# Altium schematic sheet BLDC_MC_Schematic.SchDoc
size A4; SheetNumber: 1; SheetTotal: 1
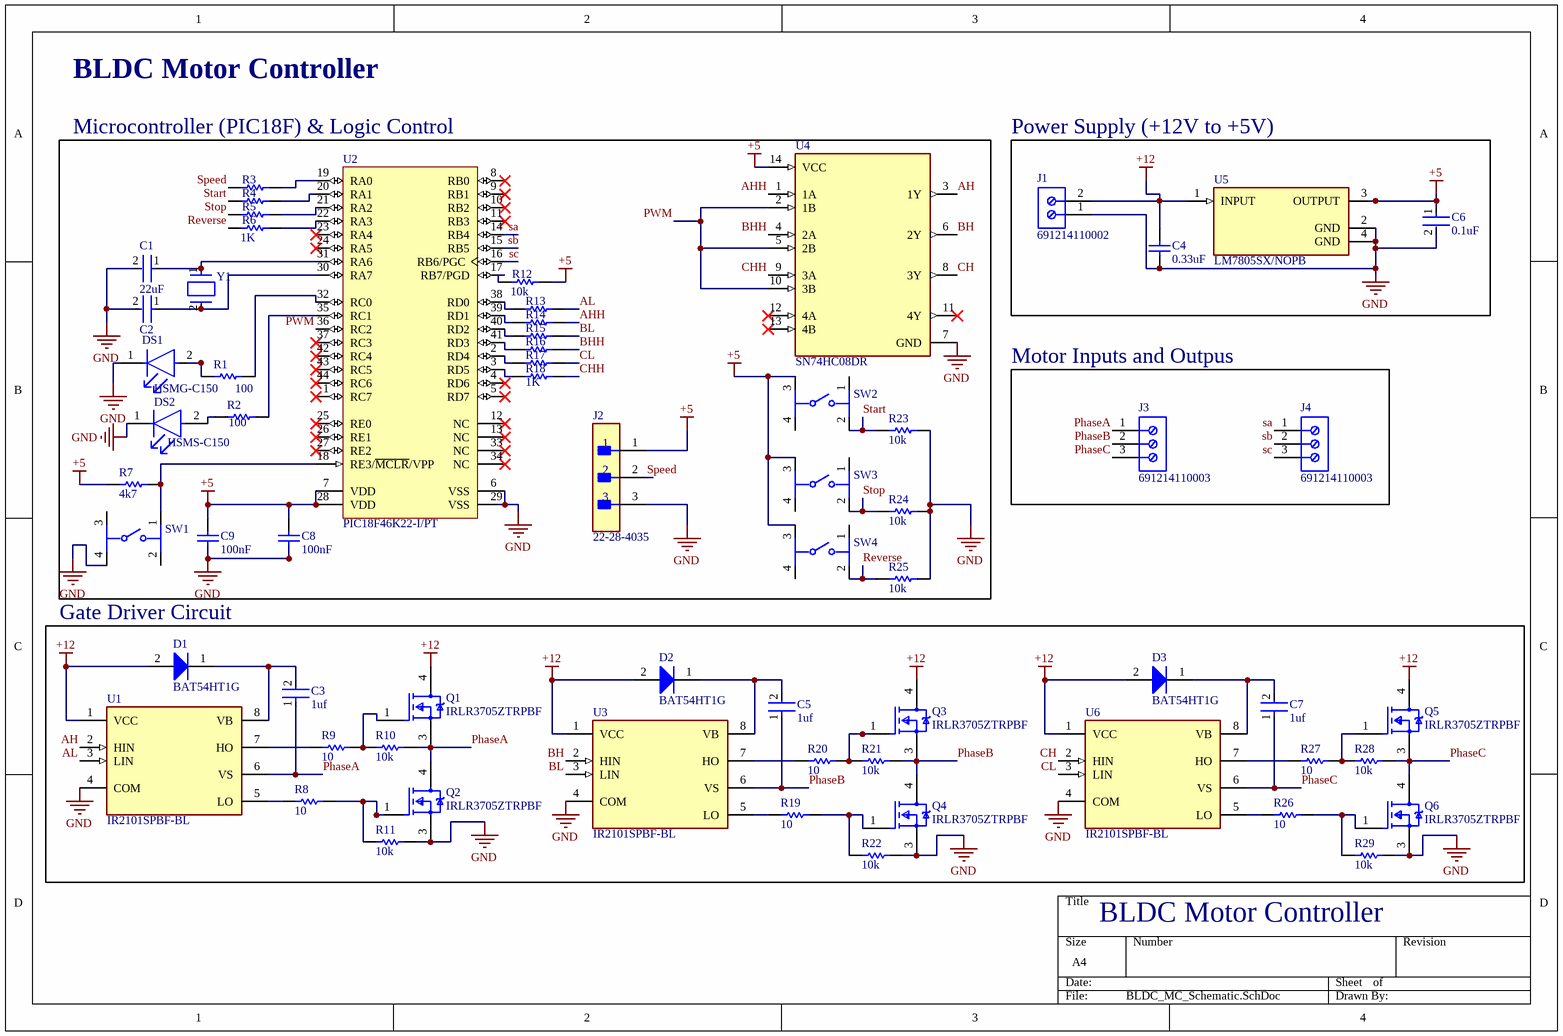
[diagram p0: BLDC_MC_Schematic.SchDoc]

## Parts
C1  22uF  [FP-GRM21B-0_15-MFG]
C2  22uF  [FP-GRM21B-0_15-MFG]  (value not drawn)
C3  1uf  [FP-GRM55D-0_4-IPC_A]
C4  0.33uF  [CAPC1005X55X25ML05T10]
C5  1uf  [FP-GRM55D-0_4-IPC_A]
C6  0.1uF  [FP-C1005-050-0_05-IPC_C]
C7  1uf  [FP-GRM55D-0_4-IPC_A]
C8  100nF  [CAPC1005X56X25ML10T15]
C9  100nF  [CAPC1005X56X25ML10T15]
D1  BAT54HT1G  [ONSC-SOD-323-2-477-02_V]
D2  BAT54HT1G  [ONSC-SOD-323-2-477-02_V]
D3  BAT54HT1G  [ONSC-SOD-323-2-477-02_V]
DS1  HSMG-C150  [FP-HSMG-C150-MFG]
DS2  HSMS-C150  [FP-HSMS-C150-MFG]
J1  691214110002  [691214110002]
J2  22-28-4035  [FP-22-28-4035-MFG]
J3  691214110003  [691214110003]
J4  691214110003  [691214110003]
Q1  IRLR3705ZTRPBF  [FP-PG-TO252-3-MFG]
Q2  IRLR3705ZTRPBF  [FP-PG-TO252-3-MFG]
Q3  IRLR3705ZTRPBF  [FP-PG-TO252-3-MFG]
Q4  IRLR3705ZTRPBF  [FP-PG-TO252-3-MFG]
Q5  IRLR3705ZTRPBF  [FP-PG-TO252-3-MFG]
Q6  IRLR3705ZTRPBF  [FP-PG-TO252-3-MFG]
R1  100  [RESC1608X55X30LL15T15]
R2  100  [RESC1608X55X30LL15T15]
R3  1K  [RESC1608X55X30LL15T15]  (value not drawn)
R4  1K  [RESC1608X55X30LL15T15]  (value not drawn)
R5  1K  [RESC1608X55X30LL15T15]  (value not drawn)
R6  1K  [RESC1608X55X30LL15T15]
R7  4k7  [RESC1005X40X25LL05T05]
R8  10  [RESC2013X50X30NL20T20]
R9  10  [RESC2013X50X30NL20T20]
R10  10k  [RESC1609X50X30NL8T20]
R11  10k  [RESC1609X50X30NL8T20]
R12  10k  [RESC1609X50X30NL8T20]
R13  1K  [RESC1608X55X30LL15T15]  (value not drawn)
R14  1K  [RESC1608X55X30LL15T15]  (value not drawn)
R15  1K  [RESC1608X55X30LL15T15]  (value not drawn)
R16  1K  [RESC1608X55X30LL15T15]  (value not drawn)
R17  1K  [RESC1608X55X30LL15T15]  (value not drawn)
R18  1K  [RESC1608X55X30LL15T15]
R19  10  [RESC2013X50X30NL20T20]
R20  10  [RESC2013X50X30NL20T20]
R21  10k  [RESC1609X50X30NL8T20]
R22  10k  [RESC1609X50X30NL8T20]
R23  10k  [RESC1609X50X30NL8T20]
R24  10k  [RESC1609X50X30NL8T20]
R25  10k  [RESC1609X50X30NL8T20]
R26  10  [RESC2013X50X30NL20T20]
R27  10  [RESC2013X50X30NL20T20]
R28  10k  [RESC1609X50X30NL8T20]
R29  10k  [RESC1609X50X30NL8T20]
SW1  PTS810SJM250SMTRLFS  [FP-PTS810SJM250SMTRLFS-MFG]  (value not drawn)
SW2  PTS810SJM250SMTRLFS  [FP-PTS810SJM250SMTRLFS-MFG]  (value not drawn)
SW3  PTS810SJM250SMTRLFS  [FP-PTS810SJM250SMTRLFS-MFG]  (value not drawn)
SW4  PTS810SJM250SMTRLFS  [FP-PTS810SJM250SMTRLFS-MFG]  (value not drawn)
U1  IR2101SPBF-BL  [FP-PG-DSO-8-IPC_B]
U2  PIC18F46K22-I/PT  [MCHP-TQFP-PT44_L]
U3  IR2101SPBF-BL  [FP-PG-DSO-8-IPC_B]
U4  SN74HC08DR  [FP-D0014A-MFG]
U5  LM7805SX/NOPB  [FP-KTT0003B-MFG]
U6  IR2101SPBF-BL  [FP-PG-DSO-8-IPC_B]
Y1  ABM7-16.000MHZ-D2Y-T  [FP-ABM7-MFG]  (value not drawn)

## Blocks framed on the sheet
Microcontroller (PIC18F) & Logic Control: C1 C2 C8 C9 DS1 DS2 J2 R1-R7 R12-R18 R23-R25 SW1-SW4 U2 U4 Y1
Power Supply (+12V to +5V): C4 C6 J1 U5
Motor Inputs and Outpus: J3 J4
Gate Driver Circuit: C3 C5 C7 D1-D3 Q1-Q6 R8-R11 R19-R22 R26-R29 U1 U3 U6

## Nets
+5: C6.1 C8.2 C9.2 J2.1 R7.1 R12.2 SW2.3 SW3.3 SW4.3 U2.7(VDD) U2.28(VDD) U4.14(VCC) U5.3(OUTPUT)
+12: C4.2 D1.2(A) D2.2(A) D3.2(A) J1.2 Q1.4(DRAIN) Q3.4(DRAIN) Q5.4(DRAIN) U1.1(VCC) U3.1(VCC) U5.1(INPUT) U6.1(VCC)
GND: C1.2 C2.2 C4.1 C6.2 C8.1 C9.1 DS1.1(C) DS2.1(C) J1.1 J2.3 Q2.3(SOURCE) Q4.3(SOURCE) Q6.3(SOURCE) R11.2 R22.2 R23.2 R24.2 R25.2 R29.2 SW1.4 U1.4(COM) U2.6(VSS) U2.29(VSS) U3.4(COM) U4.7(GND) U5.2(GND) U5.4(GND) U6.4(COM)
AH: U1.2(HIN) U4.3(1Y)
AHH: R14.2 U4.1(1A)
AL: R13.2 U1.3(LIN)
BH: U3.2(HIN) U4.6(2Y)
BHH: R16.2 U4.4(2A)
BL: R15.2 U3.3(LIN)
CH: U4.8(3Y) U6.2(HIN)
CHH: R18.2 U4.9(3A)
CL: R17.2 U6.3(LIN)
PhaseA: C3.1 J3.1 Q1.3(SOURCE) Q2.4(DRAIN) R10.2 U1.6(VS)
PhaseB: C5.1 J3.2 Q3.3(SOURCE) Q4.4(DRAIN) R21.2 U3.6(VS)
PhaseC: C7.1 J3.3 Q5.3(SOURCE) Q6.4(DRAIN) R28.2 U6.6(VS)
PWM: U2.36(RC2) U4.2(1B) U4.5(2B) U4.10(3B)
Reverse: R6.1 R25.1 SW4.2
sa: J4.1 U2.14(RB4)
sb: J4.2 U2.15(RB5)
sc: J4.3 U2.16(RB6/PGC)
Speed: J2.2 R3.1
Start: R4.1 R23.1 SW2.2
Stop: R5.1 R24.1 SW3.2
NetC1_1: C1.1 U2.31(RA6) Y1.1
NetC2_1: C2.1 U2.30(RA7) Y1.2
NetC3_2: C3.2 D1.1(K) U1.8(VB)
NetC5_2: C5.2 D2.1(K) U3.8(VB)
NetC7_2: C7.2 D3.1(K) U6.8(VB)
NetDS1_2: DS1.2(A) R1.1
NetDS2_2: DS2.2(A) R2.1
NetQ1_1: Q1.1(GATE) R9.2 R10.1
NetQ2_1: Q2.1(GATE) R8.2 R11.1
NetQ3_1: Q3.1(GATE) R20.2 R21.1
NetQ4_1: Q4.1(GATE) R19.2 R22.1
NetQ5_1: Q5.1(GATE) R27.2 R28.1
NetQ6_1: Q6.1(GATE) R26.2 R29.1
NetR1_2: R1.2 U2.32(RC0)
NetR2_2: R2.2 U2.35(RC1)
NetR3_2: R3.2 U2.19(RA0)
NetR4_2: R4.2 U2.20(RA1)
NetR5_2: R5.2 U2.21(RA2)
NetR6_2: R6.2 U2.22(RA3)
NetR7_2: R7.2 SW1.1 U2.18(RE3/~{MCLR}/VPP)
NetR8_1: R8.1 U1.5(LO)
NetR9_1: R9.1 U1.7(HO)
NetR12_1: R12.1 U2.17(RB7/PGD)
NetR13_1: R13.1 U2.38(RD0)
NetR14_1: R14.1 U2.39(RD1)
NetR15_1: R15.1 U2.40(RD2)
NetR16_1: R16.1 U2.41(RD3)
NetR17_1: R17.1 U2.2(RD4)
NetR18_1: R18.1 U2.3(RD5)
NetR19_1: R19.1 U3.5(LO)
NetR20_1: R20.1 U3.7(HO)
NetR26_1: R26.1 U6.5(LO)
NetR27_1: R27.1 U6.7(HO)

Not connected (* = marked no-connect by the designer): SW1 2 3; SW2 1 4; SW3 1 4; SW4 1 4; U2 1(RC7)* 4(RD6)* 5(RD7)* 8(RB0)* 9(RB1)* 10(RB2)* 11(RB3)* 12(NC)* 13(NC)* 23(RA4)* 24(RA5)* 25(RE0)* 26(RE1)* 27(RE2)* 33(NC)* 34(NC)* 37(RC3)* 42(RC4)* 43(RC5)* 44(RC6)*; U4 11(4Y)* 12(4A)* 13(4B)*

## Notes on the sheet
- BLDC Motor Controller
- (near R29) BLDC Motor Controller

## Library data of the parts
C1 C2 = CMP-2007-03385-2: Chip Multilayer Ceramic Capacitors for General Purpose, 0805, 22uF, X5R, 15%, 20%, 6.3V; Material: Ceramic; Max Operating Temperature: 85°C; Voltage: 6.3V; Min Operating Temperature: -55°C; Case/Package: 0805; Thickness: 0.053inch; Dielectric: X5R; Packaging: Tape and Reel; Depth: 1.25mm; Termination: SMD/SMT; Voltage Rating (DC): 6.3V; Radiation Hardening: No; Tolerance: 20%; Mount: Surface Mount; Lead Free: Lead Free; Package Quantity: 1; REACH SVHC: No SVHC; Voltage Rating: 6.3V; Capacitance: 22uF; Length: 2mm; Case Code (Imperial): 0805; Case Code (Metric): 2012; Width: 0.049inch; Height: 1.25mm
C3 C5 C7 = CMP-2000-06370-2: Chip Multilayer Ceramic Capacitors for General Purpose, 2220, 1.0uF, X7R, 15%, 10%, 250V; Width: 5mm; Capacitance: 1uF; Height: 2mm; Case Code (Imperial): 2220; Voltage Rating (DC): 250V; Max Operating Temperature: 125°C; Number of Pins: 2; Min Operating Temperature: -55°C; Termination: SMD/SMT; Case/Package: 2220; Dielectric: X7R; Material: Ceramic; REACH SVHC: No SVHC; Voltage: 250V; Packaging: Tape and Reel; Thickness: 0.087inch; Depth: 5mm; Package Quantity: 1; Tolerance: 10%; Mount: Surface Mount; Voltage Rating: 250V; Length: 5.7mm; Case Code (Metric): 5750; Lead Free: Lead Free
C4 = CMP-2008-03929-1: Part Number: GRM155R61A334KE15D; Manufacturer: Murata
C6 = CMP-2000-05393-2: Multilayer Ceramic Capacitors 100nF ±10% 50V X7R SMD 0402; Voltage: 50V; Dielectric Material: Ceramic; Min Operating Temperature: -55°C; Depth: 0.5mm; Radiation Hardening: No; RoHS Compliant: Yes; Voltage Rating (DC): 50V; Lead Free: Lead Free; Resistor Type: Ceramic; Height: 0.5mm; Dielectric: X7R; Thickness: 0.022inch; Case/Package: 0402; Case Code (Metric): 1005; Termination: SMD/SMT; Capacitance: 100nF; Packaging: Tape and Reel; Max Operating Temperature: 125°C; Mount: Surface Mount; Package Quantity: 1; Width: 0.02inch; Weight: 2.3E-05oz; Voltage Rating: 50V; Tolerance: 10%; Construction: Flat; Case Code (Imperial): 0402; Length: 1mm; REACH SVHC: No SVHC; Series: C
C8 C9 = CMP-1034-02071-2: Manufacturer: AVX Interconnect / Elco; Part Number: 0402YG104ZAT2A
D1-D3 = CMP-1055-00462-1: Schottky Barrier Diode, 2-Pin SOD-323, Pb-Free, Tape and Reel; Manufacturer: On Semiconductor; Configuration: Single; trr Max (ns): 5; IFSM Max (A): 0.6; ComponentLink3URL: http://www.onsemi.com/pub_link/Collateral/477-02.PDF.1; PackageDescription: 2-Pin SOD, Body 1.7 x 1.25 mm; ComponentLink2URL: http://www.onsemi.cn/pub_link/Collateral/BAT54HT1-D.PDF; ComponentLink3Description: Package Specification; ComponentLink2Description: Datasheet; DatasheetVersion: Rev. 6; PackageReference: SOD-323-2-477-02; RoHS: TRUE; ComponentLink1URL: http://www.onsemi.com/; Packing: Tape and Reel; PartNumber: BAT54HT1G; Mounting Technology: Surface Mount; ComponentLink1Description: Manufacturer URL; PackageVersion: Rev. H, 03/2007
DS1 = CMP-2000-05061-2: LED GREEN DIFFUSED 1206 SMD; Manufacturer: Broadcom; Led Orientation: Top View; Max Junction Temp: +95°C; Peak Emmision Wavelength: 570nm; Viewing Angle: 170°; Wavelength: 572nm; Reverse Voltage: 5V; Luminous Intensity: 15mcd; Forward Voltage: 2.2V; Power Dissipation: 65mW; Forward Current: 20mA; ComponentLink2Description: Datasheet; Lead Free: Yes; Temperature Range Low: -40°C; Package: HSMG-C150; Digikey Description: LED GREEN DIFFUSED 1206 SMD; Mouser Description: LED Uni-Color Green 570nm 2-Pin Chip LED T/R; Manufacturer Part Number: HSMG-C150; Temperature Range High: +85°C; Device Class L1: Optoelectronics; Colour: Green; Category: Diode; Device Class L3: unset; RoHS: TRUE; Height: 1.2mm; ComponentLink2URL: https://docs.broadcom.com/docs/AV02-0551EN; Device Class L2: LEDs; Automotive: No; Ipc Land Pattern Name: DIOCP320160X55; Octopart: https://octopart.com/hsmg-c150-broadcom-71131304; Temperature: -40°C to +85°C
DS2 = CMP-21615-000001-1: LED RED DIFFUSED CHIP SMD; Luminous Intensity: 10mcd; Power Dissipation: 65mW; Viewing Angle: 170°; Number of Elements: 1; Forward Current: 20mA; Lens Color: White; Lens Style: Rectangular; Wavelength: 626nm; Forward Voltage: 2.1V; Reverse Voltage: 5V; Number of Pins: 2; Color: Red; Lead Free: Lead Free; Width: 1.6mm; Length: 3.2mm; REACH SVHC: No SVHC; Height: 1.1mm; Depth: 1.6mm; Power Rating: 65mW; Package Quantity: 1; Illumination Color: Red; Radiation Hardening: No; Case Code (Imperial): 1206; Max Operating Temperature: 85°C; Test Current: 20mA; Case/Package: 1206; Lens Transparency: Diffused; Number of LEDs: 1; Packaging: Tape and Reel; Mount: Surface Mount; Min Operating Temperature: -40°C; Case Code (Metric): 3216; Dominant Wavelength: 626nm
J1 = CMP-1502-02464-2: NexarPartId: 18818288; Plating: Brass, Steel; Current: 10A; Pitch: 3.5052mm; Number of Levels: 1; Number of Contacts: 2; Wire Gauge (Min): 16AWG; Voltage: 300V; Wire Gauge (Max): 24AWG; Stripping Length: -6mm; Number of Pins: 2; Number of Rows: 1; REACH SVHC: Unknown; RoHS: Compliant; Housing Material: Nylon; Termination: Screw; Mount: Through Hole; Contact Plating: Brass, Tin; Number of Positions Per Level: 2; Color: Blue, Green; Width: 7.9mm; Voltage Rating: 300V; Length: 7.4mm; Current Rating: 10A; Wire/Cable Gauge: 24AWG; Packaging: Box; Max Operating Temperature: 105°C; Lead Pitch: 3.5mm; Height: 8.7mm; Contact Material: Brass; Min Operating Temperature: -40°C
J2 = CMP-00257-00247547-1: 22-28-4035 BOARD-BOARD Connector HEADER, 3WAY, 1ROW; Series: KK; Pitch Spacing: 2.54mm; No. of Rows: 1;; Manufacturer Lifecycle Status: ACTIVE; NexarPartId: 247547; Plating: Tin; Max Voltage Rating (DC): 250.25kV; Voltage Rating: 250V; Current Rating: 4A; Gender: Male; Glow Wire Compliant: Non-compliant; Number of Positions: 3; Connector Type: Male Pin; Contact Resistance: 20mΩ; Color: Black; Contact Plating: Gold; Contact Material: Brass; Lead Free: Lead Free; Number of Rows: 1; Housing Material: Thermoplastic; Min Operating Temperature: 0°C; Country of Origin: US; REACH SVHC: Unknown; Lifecycle Status: Production; Mount: Through Hole; Schedule B: 8536694040; RoHS: Compliant; Termination: Through Hole; Max Operating Temperature: 75°C; Pitch: 2.54mm; Packaging: Bulk; Number of Circuits: 3; Contact Mating Length: 7.493mm; Orientation: Vertical; Housing Color: Black; Number of Contacts: 3
J3 J4 = CMP-1502-02466-2: NexarPartId: 18818289; Number of Levels: 1; Voltage: 300V; Pitch: 3.5052mm; Stripping Length: -6mm; Number of Positions Per Level: 3; Plating: Brass, Steel; Wire/Cable Gauge: 24AWG; Wire Gauge (Min): 16AWG; Current Rating: 10A; Width: 10.9mm; Length: 7.4mm; Housing Material: Nylon; Height: 12.2mm; Min Operating Temperature: -40°C; Contact Plating: Brass, Tin; Packaging: Box; Color: Blue, Green; Number of Contacts: 3; Number of Pins: 3; Voltage Rating: 300V; Termination: Screw; Lead Pitch: 3.5mm; Max Operating Temperature: 105°C; Mount: Through Hole; Contact Material: Brass; RoHS: Compliant; Wire Gauge (Max): 24AWG; Current: 10A; REACH SVHC: Unknown
Q1-Q6 = CMP-32901-000105-2: MOSFET N-CH 55V 42A DPAK; Octopart: https://octopart.com/irlr3705ztrpbf-infineon-65875040
R1 R2 = CMP-2000-00179-1: Manufacturer: Panasonic; Part Number: ERJ-3EKF1000V
R3-R6 R13-R18 = CMP-2000-00180-1: Part Number: ERJ-3EKF1001V; Manufacturer: Panasonic
R7 = CMP-2002-01154-4: Chip Resistor, 4.7 KOhm, +/- 1%, 0.1 W, -55 to 155 degC, 0402 (1005 Metric), RoHS, Tape and Reel; PartNumber: ERJ-2RKF4701X; Voltage Rating: 50 V; Case\/Package: 0402; Power Rating: 100 mW; Height: 0.35 mm; Mounting Technology: Surface Mount; REACH SVHC: Yes; Resistance: 4.7 KOhm; Max Operating Temperature: 155 degC; ComponentLink1Description: Manufacturer URL; ComponentLink2Description: Datasheet; Pins: 2; PackageReference: 0402; Tolerance: 1%; Case Code (Imperial): 0402; Length: 1 mm; PackageDescription: 2-Pin Surface Mount Device, Body 1 x 0.5 mm; RoHSCompliant: true; Package Quantity: 1; Radiation Hardening: No; DatasheetVersion: 04/2015; Width: 0.5 mm; Case Code (Metric): 1005; Mount: Surface Mount; ComponentLink1URL: http://www.panasonic.com/; Min Operating Temperature: -55 degC; Packaging: Cut Tape; ComponentLink2URL: http://industrial.panasonic.com/cdbs/www-data/pdf/RDA0000/AOA0000C86.pdf
R8 R9 R19 R20 R26 R27 = CMP-2001-04915-1: Manufacturer: Vishay Dale; Part Number: CRCW080510R0FKEA
R10-R12 R21-R25 R28 R29 = CMP-1666-00005-4: Chip Resistor, 10 KOhm, +/- 1%, 100 mW, -55 to 155 degC, 0603 (1608 Metric), RoHS, Tape and Reel; Manufacturer: Vishay Semiconductor; Voltage Rating: 75 V; Max Operating Temperature: 155 degC; PackageDescription: 2-Pin Surface Mount Device, Body 1.575 x 0.85 mm; ComponentLink1Description: Manufacturer URL; RoHSCompliant: true; PackageReference: 0603; REACH SVHC: Unknown; Length: 1.55 mm; DatasheetVersion: 06/2012; Packaging: Tape and Reel; Min Operating Temperature: -55 degC; Mounting Technology: Surface Mount; ComponentLink2URL: https://datasheet.ciiva.com/11809/0900766b80d98afc-11809037.pdf; Height: 0.45 mm; ComponentLink2Description: Datasheet; Package Quantity: 5000; ComponentLink1URL: http://www.vishay.com/
SW1-SW4 = CMP-10040-000001-2: SWITCH TACTILE SPST-NO 0.05A 16V; Throw Configuration: SPST; Operating Force: 160gf; Actuator Type: Standard; Switch Travel: 0.15mm; Switch Function: Off-Mom; Max Current Rating: 50mA; Mechanical Life: 150000Cycles; Illumination Type: Non-Illuminated; Package Quantity: 2900; Depth: 4.6mm; Mount: Surface Mount; Packaging: Tape and Reel; Length: 3.2mm; RoHS Compliant: Yes; Case/Package: SMD/SMT; Voltage Rating (DC): 16V; Min Operating Temperature: -40°C; Termination: J-Bend; Lead Free: Lead Free; Contact Plating: Silver; Orientation: Straight; Max Operating Temperature: 85°C; Current Rating: 50mA; Color: Black
U1 U3 U6 = CMP-32851-000156-1: MOSFET DRVR 600V 0.36A 2-OUT Hi/Lo Side Non-Inv 8-Pin SOIC
U2 = CMP-0116-01786-1: Low-Power, High-Performance Microcontroller with XLP Technology, 64 MHz, 35 I/O, -40 to 85 degC, 44-pin TQFP (PT44), Tray; Manufacturer: Microchip; Timers: 3 - 8-bit, 4 - 16-bit; EEPROM Data Memory (bytes): 1024; Program Memory KBytes: 64; # of A/D Channels: 28; Digital Communication: 2 -A/E/USART, 2 -MSSP(SPI/I2C); Memory Type: Flash; RAM: 3896; Internal Oscillator: 16 MHz, 31 kHz; I/O Pins: 35; Operation Voltage Range: 2.3V - 5.5V; Program Memory KWords: 32; PackageDescription: 44-Lead Plastic Thin Quad Flatpack, 10 x 10 mm Body, 0.8 mm Pitch; ComponentLink1URL: http://ww1.microchip.com/downloads/en/DeviceDoc/41412F.pdf; PackageVersion: C04-076B, 12/2012; Packing: TRAY; Mounting Technology: Surface Mount; DatasheetVersion: Rev. F; ComponentLink3URL: Product URL:http://www.microchip.com/datasheet/PIC18F46K22; PartNumber: PIC18F46K22-I/PT; ComponentLink3Description: URL Link1; Max. CPU Speed MHz: 64; ComponentLink2URL: http://www.microchip.com/stellent/groups/techpub_sg/documents/packagingspec/en012702.pdf; ComponentLink1Description: Datasheet; RoHS: TRUE; PackageReference: TQFP-PT44; ComponentLink2Description: Package Specification
U4 = CMP-0777-00016-4: IC GATE AND 4CH 2-INP 14SOIC; Output Current: 25mA; Number of Elements: 4; High Level Output Current: -5.2mA; Number of Outputs: 1; Quiescent Current: 2uA; Propagation Delay: 17ns; Max Supply Voltage: 6V; Turn-On Delay Time: 21ns; Low Level Output Current: 5.2mA; Number of Inputs: 2; Logic Function: AND GATE; Operating Supply Voltage: 5V; Min Supply Voltage: 2V; Radiation Hardening: No; Number of Pins: 14; Mount: Surface Mount; REACH SVHC: No SVHC; RoHS Compliant: Yes; Max Operating Temperature: 85°C; Case/Package: SOIC; Weight: 0.004318oz; Min Operating Temperature: -40°C; Number of Bits: 4; Number of Circuits: 4; Lead Free: Lead Free; Contact Plating: Gold; Number of Input Lines: 2; Packaging: Tape and Reel; Number of Output Lines: 1; Package Quantity: 1; Number of Gates: 4
U5 = CMP-2000-07590-2: IC REG LIN 5V 1.5A DDPAK/TO263-3; Manufacturer: Texas Instruments; Standoff Height: 0mm; Number Of Outputs: 1; Nominal Supply Current: 8mA; Output Type: Fixed; Accuracy Percentage: 3%; Dropout Voltage: 2V; Min Supply Voltage: 7.5V; Max Junction Temp: +150°C; Max Supply Voltage: 30V; Device Class L1: Integrated Circuits (ICs); Mouser Description: 1.5-A, Wide VIN Fixed Voltage Regulators 3-DDPAK/TO-263 0 to 0; Device Class L3: Voltage Regulators - Linear; Height: 4.79mm; Temperature Range High: +125°C; Manufacturer Part Number: LM7805SX/NOPB; Octopart: https://octopart.com/lm7805sx%2Fnopb-texas+instruments-74629994; Automotive: No; Output Voltage: 5V; Lead Free: Yes; Digikey Description: IC REG LIN 5V 1.5A DDPAK/TO263-3; Package: KTT0003B; Device Class L2: Power Management ICs; ComponentLink2URL: http://www.ti.com/lit/ds/symlink/lm7800.pdf; Category: IC; Temperature Range Low: 0°C; Ambient Temperature Range High: +125°C; Output Current: 1.5A; Ambient Temperature Range Low: 0°C; RoHS: TRUE; Temperature: 0°C to +125°C; ComponentLink2Description: Datasheet
Y1 = CMP-27762-000095-1: Crystal 16MHz ±20ppm 18pF SMD-2 6mm x 3.5mm; ESR (Equivalent Series Resistance): 50R; Frequency Stability: 30ppm; Width: 3.3mm; Frequency: 16MHz; Radiation Hardening: No; Height: 0.055inch; Tolerance: 20ppm; Length: 6mm; Case/Package: CSMD; Lead Free: Lead Free; Min Operating Temperature: -40°C; Termination: SMD/SMT; Operating Frequency: 16 MHz; Resistor Type: Ceramic; Packaging: Tape and Reel; Mount: Surface Mount; Load Capacitance: 18pF; Frequency Tolerance: 20ppm; Depth: 3.5mm; Series: ABM7; Package Quantity: 1000; Max Operating Temperature: 85°C; Number of Pins: 2